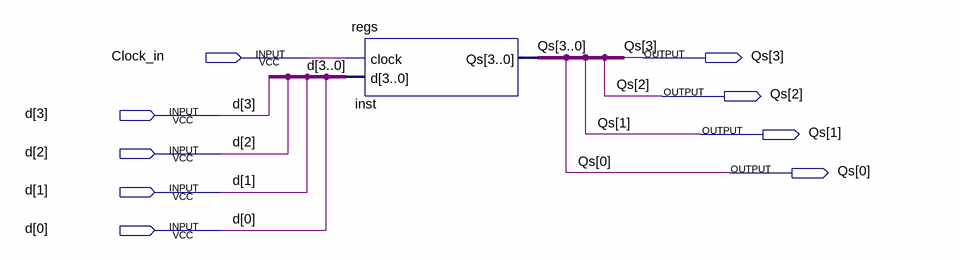
[diagram p0: schematic sheet]
// Quartus schematic Lab_7.bdf as structural Verilog: 1 symbols, 9 pins
module Lab_7 (
  input  Clock_in,
  input  [3:0] d,
  output [3:0] Qs
);

  regs inst (.clock(Clock_in), .d(d), .Qs(Qs));
endmodule
